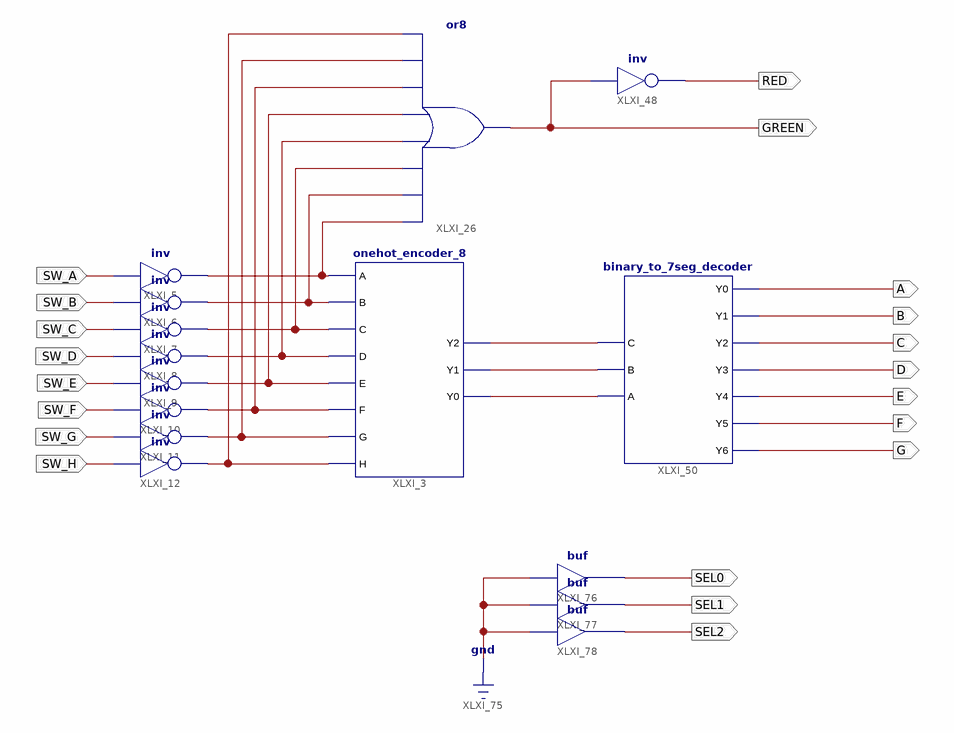
[diagram p0: schematic sheet 1]
// Xilinx ISE schematic top_level.sch (zynq) as structural Verilog: 15 symbols, 20 ports
module top_level (
  input  SW_A,
  input  SW_B,
  input  SW_C,
  input  SW_D,
  input  SW_E,
  input  SW_F,
  input  SW_G,
  input  SW_H,
  output GREEN,
  output RED,
  output A,
  output B,
  output C,
  output D,
  output E,
  output F,
  output G,
  output SEL0,
  output SEL1,
  output SEL2
);

  wire XLXN_34, XLXN_35, XLXN_36, XLXN_37, XLXN_124, XLXN_125, XLXN_126, XLXN_127, XLXN_128, XLXN_129,
       XLXN_130;

  not XLXI_5 (XLXN_34, SW_A);
  not XLXI_6 (XLXN_35, SW_B);
  not XLXI_7 (XLXN_36, SW_C);
  not XLXI_8 (XLXN_37, SW_D);
  not XLXI_10 (XLXN_125, SW_F);
  not XLXI_11 (XLXN_126, SW_G);
  not XLXI_12 (XLXN_127, SW_H);
  not XLXI_9 (XLXN_124, SW_E);
  onehot_encoder_8 XLXI_3 (
    .E(XLXN_124), .F(XLXN_125), .G(XLXN_126), .H(XLXN_127), .Y1(XLXN_129), .Y0(XLXN_130), .Y2(XLXN_128),
    .D(XLXN_37), .A(XLXN_34), .B(XLXN_35), .C(XLXN_36));
  or XLXI_26 (GREEN, XLXN_34, XLXN_35, XLXN_36, XLXN_37, XLXN_124, XLXN_125, XLXN_126, XLXN_127);
  not XLXI_48 (RED, GREEN);
  binary_to_7seg_decoder XLXI_50 (
    .B(XLXN_129), .Y0(A), .Y1(B), .Y2(C), .Y3(D), .Y4(E), .Y5(F), .Y6(G), .C(XLXN_128), .A(XLXN_130));
  buf XLXI_76 (SEL0, 1'b0);
  buf XLXI_77 (SEL1, 1'b0);
  buf XLXI_78 (SEL2, 1'b0);
endmodule
